# EAGLE design CharliesAlienWhoopF4 (EAGLE 8.1.0)
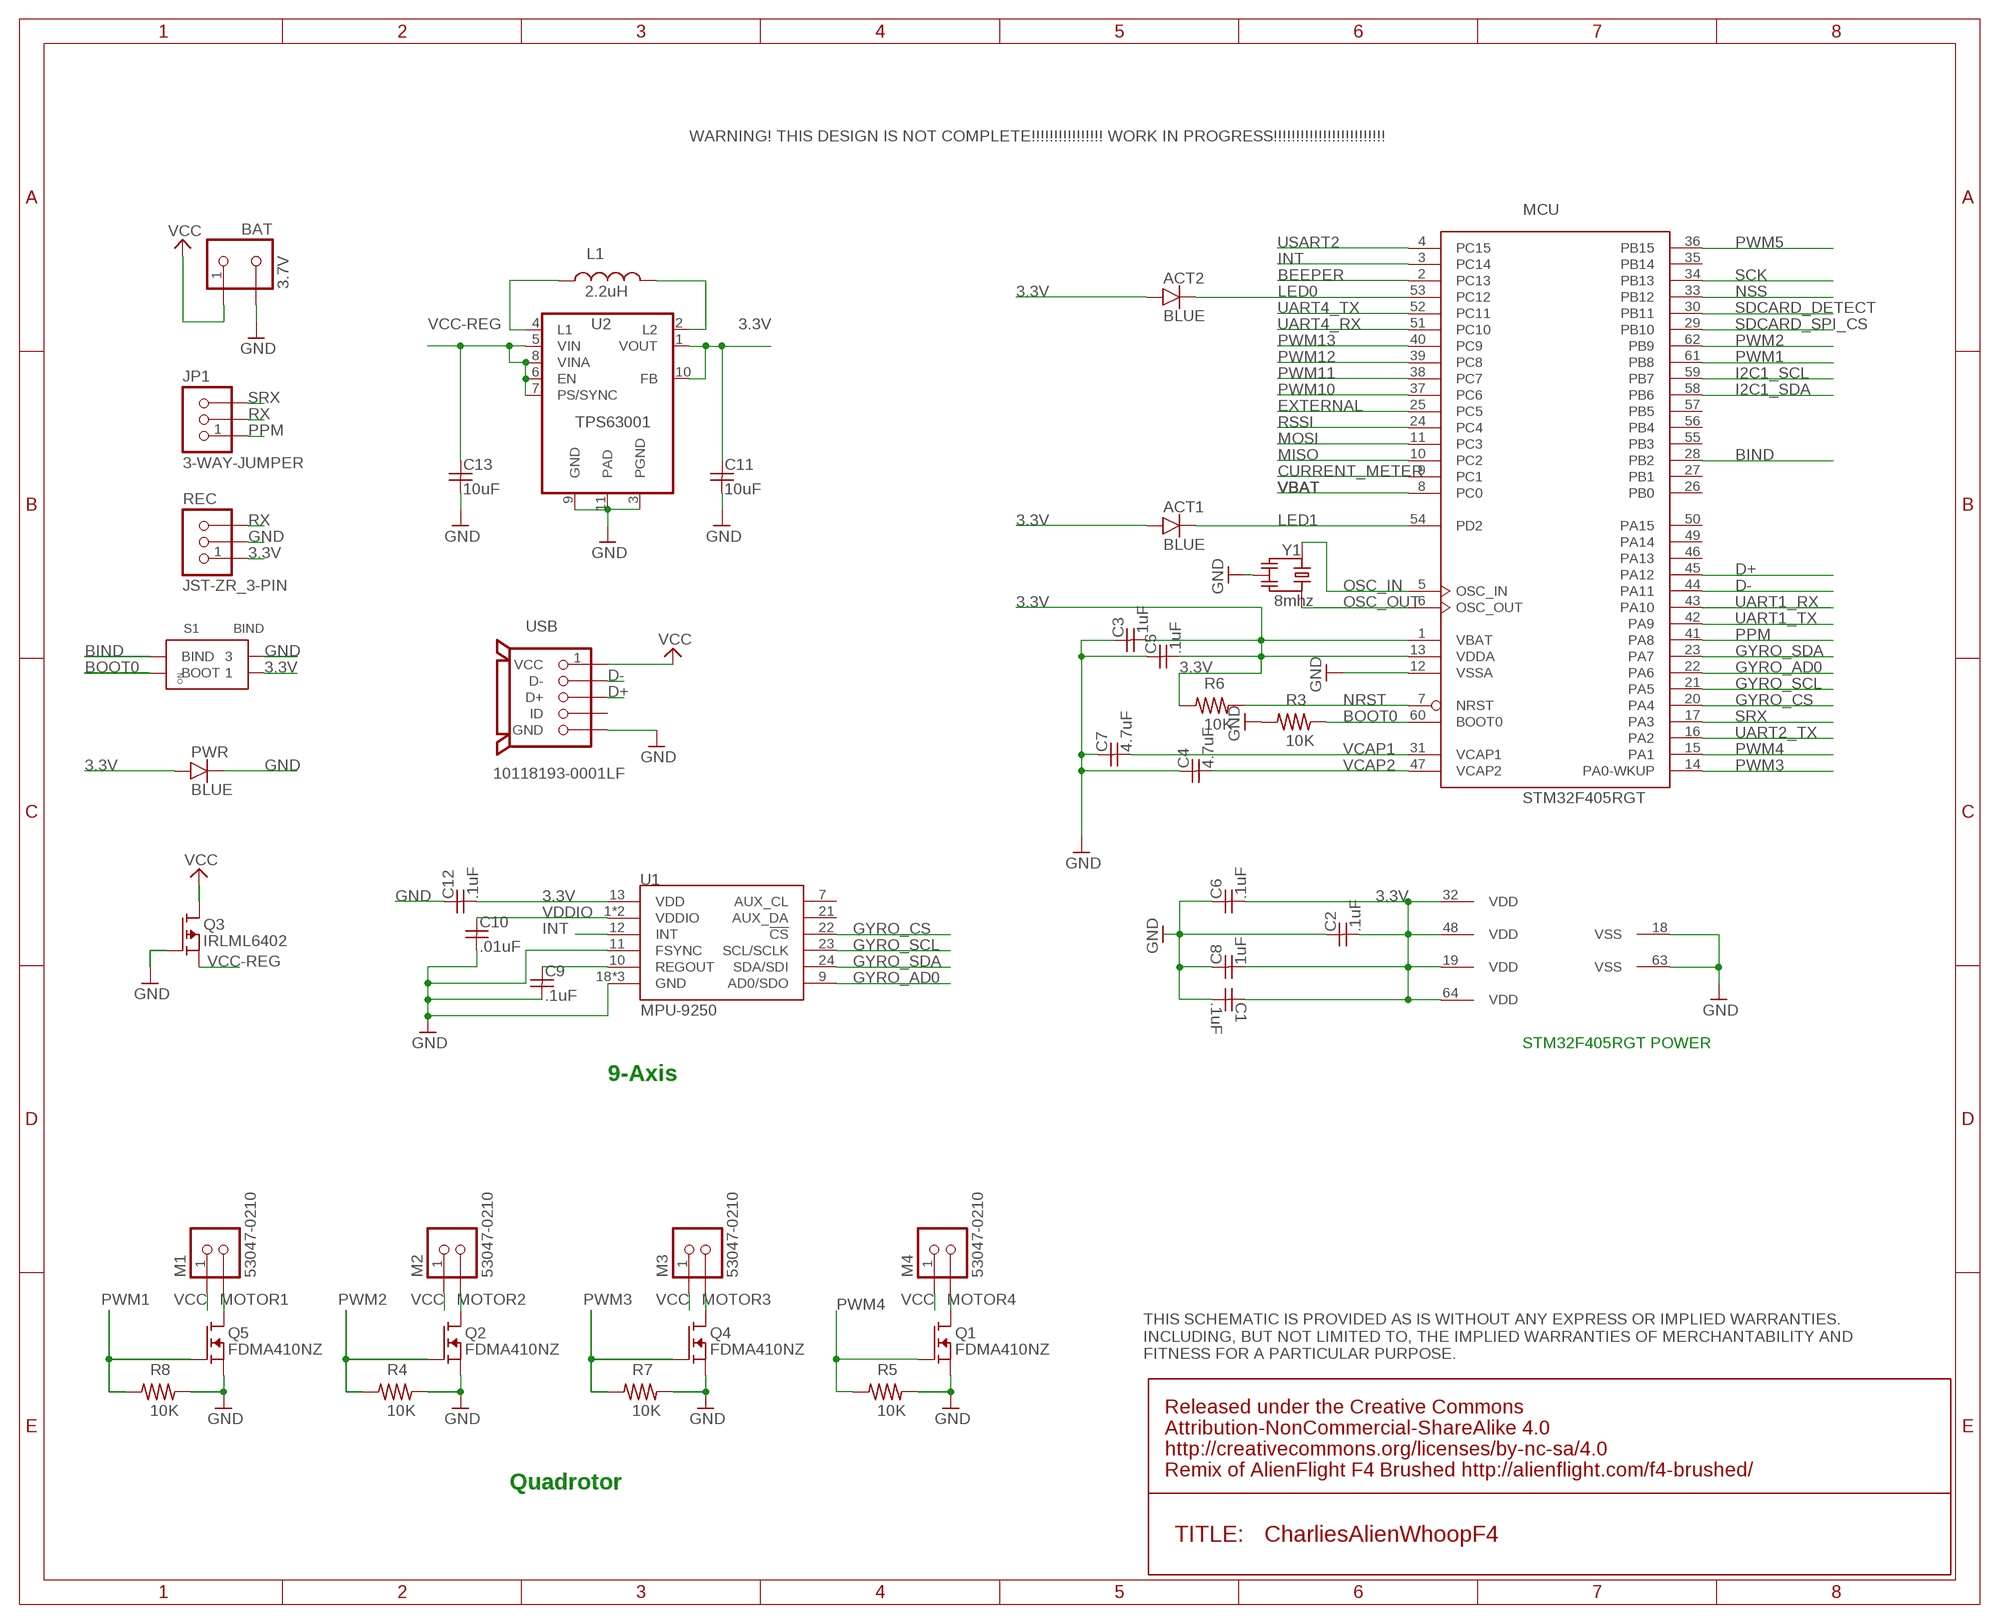
[diagram p0: schematic, sheet 1]

## Parts
ACT1  BLUE  SMD-CHIP-LED-0805  [SMD-CHIP-LED-0805]
ACT2  BLUE  SMD-CHIP-LED-0805  [SMD-CHIP-LED-0805]
BAT  3.7V  JST-PH-BAT  [S2B-PH-K-S]
C1  .1uF  CAPACITOR.1UF  [MUR-CAP-0603]
C2  .1uF  CAPACITOR.1UF  [MUR-CAP-0603]
C3  .1uF  CAPACITOR.1UF  [MUR-CAP-0603]
C4  4.7uF  CAPACITOR4.7UF  [MUR-CAP-0603]
C5  .1uF  CAPACITOR.1UF  [MUR-CAP-0603]
C6  .1uF  CAPACITOR.1UF  [MUR-CAP-0603]
C7  4.7uF  CAPACITOR4.7UF  [MUR-CAP-0603]
C8  1uF  CAPACITOR1UF  [MUR-CAP-0603]
C9  .1uF  CAPACITOR.1UF  [MUR-CAP-0603]
C10  .01uF  CAPACITOR.01UF  [MUR-CAP-0603]
C11  10uF  CAPACITOR10UF  [YUDEN-CAP-0805]
C12  .1uF  CAPACITOR.1UF  [MUR-CAP-0603]
C13  10uF  CAPACITOR10UF  [YUDEN-CAP-0805]
JP1  3-WAY-JUMPER  [3-WAY-JUMPER]
L1  2.2uH  NR301X  [NR301X]
M1  53047-0210  PICO-1.25-MOTOR  [PICO-53047-02]
M2  53047-0210  PICO-1.25-MOTOR  [PICO-53047-02]
M3  53047-0210  PICO-1.25-MOTOR  [PICO-53047-02]
M4  53047-0210  PICO-1.25-MOTOR  [PICO-53047-02]
MCU  STM32F405RGT  [LQFP64]
PWR  BLUE  SMD-CHIP-LED-0805  [SMD-CHIP-LED-0805]
Q1  FDMA410NZ  [MICROFET-2X2]
Q2  FDMA410NZ  [MICROFET-2X2]
Q3  IRLML6402  MOSFET-P  [SOT-23]
Q4  FDMA410NZ  [MICROFET-2X2]
Q5  FDMA410NZ  [MICROFET-2X2]
R3  10K  RESISTOR10K  [VISH-RES-0603]
R4  10K  RESISTOR10K  [VISH-RES-0603]
R5  10K  RESISTOR10K  [VISH-RES-0603]
R6  10K  RESISTOR10K  [VISH-RES-0603]
R7  10K  RESISTOR10K  [VISH-RES-0603]
R8  10K  RESISTOR10K  [VISH-RES-0603]
REC  JST-ZR_3-PIN  [S3B-ZR]
S1  BIND  2POS-DIP-SWITCH  [A6H-2101]
U1  MPU-9250  [QFN24_PAD]
U2  TPS63001  TPS630XX-TPS63001  [VSON-N10]
USB  10118193-0001LF  USB-MICRO-B-FCI  [10118193-0001LF]
Y1  8mhz  RESONATOR8MHZ  [RESONATOR_8]

## Nets
3.3V: ACT1.A ACT2.A C1.1 C2.2 C3.2 C5.2 C6.2 C8.2 C11.1 C12.2 MCU.1(VBAT) MCU.13(VDDA) MCU.19(VDD) MCU.32(VDD) MCU.48(VDD) MCU.64(VDD) PWR.A R6.2 REC.1 S1.BOOT_1 U1.13(VDD) U2.1(VOUT) U2.10(FB)
BEEPER: MCU.2(PC13)
BIND: MCU.28(PB2) S1.BIND_2(BIND)
BOOT0: MCU.60(BOOT0) R3.1 S1.BOOT_2(BOOT)
CURRENT_METER: MCU.9(PC1)
D+: MCU.45(PA12) USB.3(D+)
D-: MCU.44(PA11) USB.2(D-)
EXTERNAL: MCU.25(PC5)
GND: BAT.2 C1.2 C2.1 C3.1 C4.1 C5.1 C6.1 C7.1 C8.1 C9.2 C10.2 C11.2 C12.1 C13.2 MCU.12(VSSA) MCU.18(VSS) MCU.63(VSS) PWR.C Q1.S Q1.S1(S) Q2.S Q2.S1(S) Q3.1(G) Q4.S Q4.S1(S) Q5.S Q5.S1(S) R3.2 R4.1 R5.1 R7.1 R8.1 REC.2 S1.BIND_1 U1.11(FSYNC) U1.18(GND) U1.20(GND) U1.CENTER(GND) U2.3(PGND) U2.9(GND) U2.11(PAD) USB.5(GND) USB.GND USB.GND2(GND) USB.HOLE1(GND) USB.HOLE2(GND) Y1.2
GYRO_AD0: MCU.22(PA6) U1.9(AD0/SDO)
GYRO_CS: MCU.20(PA4) U1.22(!CS)
GYRO_SCL: MCU.21(PA5) U1.23(SCL/SCLK)
GYRO_SDA: MCU.23(PA7) U1.24(SDA/SDI)
I2C1_SCL: MCU.59(PB7)
I2C1_SDA: MCU.58(PB6)
INT: MCU.3(PC14) U1.12(INT)
L1: L1.1 U2.4(L1)
L2: L1.2 U2.2(L2)
LED0: ACT2.C MCU.53(PC12)
LED1: ACT1.C MCU.54(PD2)
MISO: MCU.10(PC2)
MOSI: MCU.11(PC3)
MOTOR1: M1.2 Q5.D Q5.D1(D) Q5.D2(D) Q5.D3(D) Q5.D4(D)
MOTOR2: M2.2 Q2.D Q2.D1(D) Q2.D2(D) Q2.D3(D) Q2.D4(D)
MOTOR3: M3.2 Q4.D Q4.D1(D) Q4.D2(D) Q4.D3(D) Q4.D4(D)
MOTOR4: M4.2 Q1.D Q1.D1(D) Q1.D2(D) Q1.D3(D) Q1.D4(D)
NRST: MCU.7(NRST) R6.1
NSS: MCU.33(PB12)
OSC_IN: MCU.5(OSC_IN) Y1.1
OSC_OUT: MCU.6(OSC_OUT) Y1.3
PPM: JP1.1 MCU.41(PA8)
PWM1: MCU.61(PB8) Q5.G R8.2
PWM2: MCU.62(PB9) Q2.G R4.2
PWM3: MCU.14(PA0-WKUP) Q4.G R7.2
PWM4: MCU.15(PA1) Q1.G R5.2
PWM5: MCU.36(PB15)
PWM10: MCU.37(PC6)
PWM11: MCU.38(PC7)
PWM12: MCU.39(PC8)
PWM13: MCU.40(PC9)
REGOUT: C9.1 U1.10(REGOUT)
RSSI: MCU.24(PC4)
RX: JP1.2 REC.3
SCK: MCU.34(PB13)
SDCARD_DETECT: MCU.30(PB11)
SDCARD_SPI_CS: MCU.29(PB10)
SRX: JP1.3 MCU.17(PA3)
UART1_RX: MCU.43(PA10)
UART1_TX: MCU.42(PA9)
UART2_TX: MCU.16(PA2)
UART4_RX: MCU.51(PC10)
UART4_TX: MCU.52(PC11)
USART2: MCU.4(PC15)
VBAT: MCU.8(PC0)
VCAP1: C7.2 MCU.31(VCAP1)
VCAP2: C4.2 MCU.47(VCAP2)
VCC: BAT.1 M1.1 M2.1 M3.1 M4.1 Q3.3(D) USB.1(VCC)
VCC-REG: C13.1 Q3.2(S) U2.5(VIN) U2.6(EN) U2.7(PS/SYNC) U2.8(VINA)
VDDIO: C10.1 U1.1(VDDIO) U1.8(VDDIO)
Unconnected: MCU.26(PB0) MCU.27(PB1) MCU.35(PB14) MCU.46(PA13) MCU.49(PA14) MCU.50(PA15) MCU.55(PB3) MCU.56(PB4) MCU.57(PB5) U1.7(AUX_CL) U1.21(AUX_DA) USB.4(ID)

## Notes on the sheet
- WARNING! THIS DESIGN IS NOT COMPLETE!!!!!!!!!!!!!!!! WORK IN PROGRESS!!!!!!!!!!!!!!!!!!!!!!!!!
- STM32F405RGT POWER
- 9-Axis
- THIS SCHEMATIC IS PROVIDED AS IS WITHOUT ANY EXPRESS OR IMPLIED WARRANTIES.
   INCLUDING, BUT NOT LIMITED TO, THE IMPLIED WARRANTIES OF MERCHANTABILITY AND
   FITNESS FOR A PARTICULAR PURPOSE.
- Quadrotor

## Library data of the parts
ACT1 ACT2 PWR = alienflight:SMD-CHIP-LED-0805: SMD CHIP LED APHCM2012QBC/D-F01 View Datasheet <https://www.kingbrightusa.com/images/catalog/spec/APHCM2012QBC-D-F01.pdf> Author: Lance Source: http://alienflight.com License: CC BY SA <creativecommons.org/licenses/by-sa/4.0/>; MF: Kingbright; MPN: APHCM2012QBC/D-F01
BAT = alienflight:JST-PH-BAT: Battery Connector JST- S2B-PH-K-S View Datasheet <http://www.jst-mfg.com/product/pdf/eng/ePH.pdf> Author: Lance Source: http://alienflight.com License: CC BY SA <creativecommons.org/licenses/by-sa/4.0/>; MF: JST; MPN: S2B-PH-K-S
C1-C3 C5 C6 C9 C12 = alienflight:CAPACITOR: CAPACITORS Murata Datasheet <http://www.murata.com/~/media/webrenewal/support/library/catalog/products/capacitor/mlcc/c02e.ashx?la=en-us> Taiyo Yuden Datasheet <http://www.mouser.com/ds/2/396/mlcc11_hq_e-541564.pdf> Author: Lance Source: http://alienflight.com License: CC BY SA <creativecommons.org/licenses/by-sa/4.0/>; MF: Murata; MPN: GRM188R71C104KA01D
C4 C7 = alienflight:CAPACITOR: CAPACITORS Murata Datasheet <http://www.murata.com/~/media/webrenewal/support/library/catalog/products/capacitor/mlcc/c02e.ashx?la=en-us> Taiyo Yuden Datasheet <http://www.mouser.com/ds/2/396/mlcc11_hq_e-541564.pdf> Author: Lance Source: http://alienflight.com License: CC BY SA <creativecommons.org/licenses/by-sa/4.0/>; MF: Murata; MPN: GRJ188C70J475KE11D
C8 = alienflight:CAPACITOR: CAPACITORS Murata Datasheet <http://www.murata.com/~/media/webrenewal/support/library/catalog/products/capacitor/mlcc/c02e.ashx?la=en-us> Taiyo Yuden Datasheet <http://www.mouser.com/ds/2/396/mlcc11_hq_e-541564.pdf> Author: Lance Source: http://alienflight.com License: CC BY SA <creativecommons.org/licenses/by-sa/4.0/>; MF: Murata; MPN: GRM188R71C105KA12D
C10 = alienflight:CAPACITOR: CAPACITORS Murata Datasheet <http://www.murata.com/~/media/webrenewal/support/library/catalog/products/capacitor/mlcc/c02e.ashx?la=en-us> Taiyo Yuden Datasheet <http://www.mouser.com/ds/2/396/mlcc11_hq_e-541564.pdf> Author: Lance Source: http://alienflight.com License: CC BY SA <creativecommons.org/licenses/by-sa/4.0/>; MF: Murata; MPN: GRM188R71C103KA01D
C11 C13 = alienflight:CAPACITOR: CAPACITORS Murata Datasheet <http://www.murata.com/~/media/webrenewal/support/library/catalog/products/capacitor/mlcc/c02e.ashx?la=en-us> Taiyo Yuden Datasheet <http://www.mouser.com/ds/2/396/mlcc11_hq_e-541564.pdf> Author: Lance Source: http://alienflight.com License: CC BY SA <creativecommons.org/licenses/by-sa/4.0/>; MF: Taiyo Yuden; MPN: JMK212AB7106KG-T
JP1 = alienflight:3-WAY-JUMPER: 3 Way Jumper
L1 = alienflight:NR301X: 3X3mm Inductor NR3015T2R2M - Datasheet <http://datasheet.octopart.com/NR3015T2R2M-Taiyo-Yuden-datasheet-41181804.pdf> Author: Lance Source: http://alienflight.com License: CC BY SA <creativecommons.org/licenses/by-sa/4.0/>; MF: Taiyo Yuden; MPN: NR3015T2R2M
M1-M4 = alienflight:PICO-1.25-MOTOR: Motor Connector PicoBlade 1.25 53047-02 View Datasheet <http://www.molex.com/webdocs/datasheets/pdf/en-us/0530470210_PCB_HEADERS.pdf> Author: Lance Source: http://alienflight.com License: CC BY SA <creativecommons.org/licenses/by-sa/4.0/>; MF: MOLEX; MPN: 53047-0210
MCU = micro-stm_v2:STM32F405R*T: ARM 32-bit Cortex™-M3 CPU 168 MHz maximum frequency 1024 Kbytes of Flash memory 192 kbytes of SRAM 51 GPIOs 1.8 to 3.6 V application supply
Q1 Q2 Q4 Q5 = alienflight:FDMA410NZ: N-Channel MOSFET FDMA410NZ View Datasheet <https://www.fairchildsemi.com/datasheets/FD/FDMA410NZ.pdf> Author: Lance Source: http://alienflight.com License: CC BY SA <creativecommons.org/licenses/by-sa/4.0/>; MF: Fairchild; MPN: FDMA410NZ
Q3 = alienflight:MOSFET-P: P-Channel MOSFET IRLML6402 Datasheet <http://www.irf.com/product-info/datasheets/data/irlml6402pbf.pdf> Author: Lance Source: Alienflight.com License: CC BY SA <creativecommons.org/licenses/by-sa/4.0/>; MF: IR; MPN: IRLML6402
R3-R8 = alienflight:RESISTOR: RESISTORS Vishay DataSheet <http://www.vishay.com/docs/20043/crcwhpe3.pdf> Author: Lance (100 ohm variant by Charlie Stevenson) Source: http://alienflight.com License: CC BY SA <creativecommons.org/licenses/by-sa/4.0/>; MF: Vishay; MPN: CRCW060310K0FKEAHP
REC = alienflight:JST-ZR_3-PIN: 3 Pin Receiver JST - S3B-ZR View Datasheet <http://www.jst-mfg.com/product/pdf/eng/eZH.pdf> Author: Lance Source: http://alienflight.com License: CC BY SA <creativecommons.org/licenses/by-sa/4.0/>; MF: JST; MPN: S3B-ZR
S1 = CharliesAlienWhoop:2POS-DIP-SWITCH: 2 Position Dip Switch
U1 = Testing:MPU-9250: NC pin 19. 2-6 & 14-17 not internally connected. May be used for PCB trace routing.; PROD_ID: IC-13192
U2 = alienflight:TPS630XX: Buck/Boost Converter TPS63001/2 Datasheet <http://www.ti.com/lit/ds/symlink/tps63001.pdf> Author: Lance Source: http://alienflight.com License: CC BY SA <creativecommons.org/licenses/by-sa/4.0/>; MF: TI; MPN: TPS63001DRCR
USB = alienflight:USB-MICRO-B: Micro-B USB Connector Author: Lance Source: http://alienflight.com License: CC BY SA <creativecommons.org/licenses/by-sa/4.0/>; MF: FCI; MPN: 10118193-0001LF
Y1 = alienflight:RESONATOR: SMD Ceramic Resonators Ceralock Murata Datasheet <http://www.murata.com/~/media/webrenewal/support/library/catalog/products/timingdevice/ceralock/p16e.ashx> Author: Lance Source: http://alienflight.com License: CC BY SA <creativecommons.org/licenses/by-sa/4.0/>; MF: Murata; MPN: CSTCE8M00G55-R0

## Board
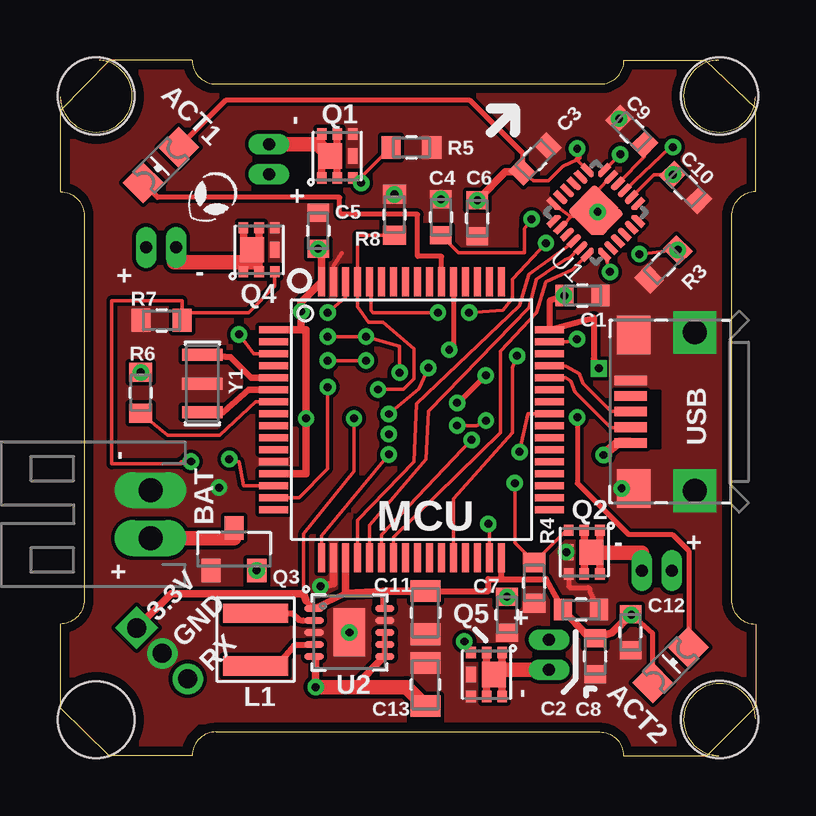
[diagram p1: board, top side]
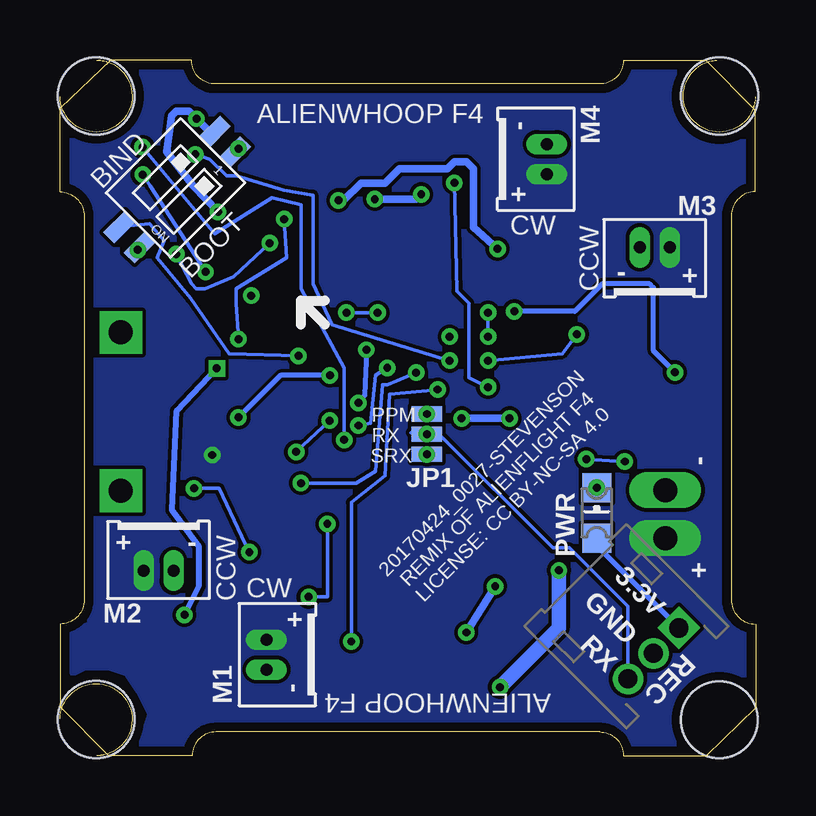
[diagram p2: board, bottom side, seen from below]

Size 29.01 x 28.99 mm. Coordinates in mm from the lower left corner, seen from the top.
Outline: 0.01,27.45 0.02,27.38
Outline: 0.02,27.34 0.02,27.33 0.02,27.3 0.04,27.23
Outline: 0.04,27.18 0.04,27.23
Outline: 0.04,27.23 0.04,27.19 0.04,27.18
Outline: 0.04,27.18 0.05,27.16 0.07,27.08
Outline: 0.08,27.05 0.07,27.08
Outline: 0.07,27.08 0.08,27.05 0.08,27.05
Outline: 0.08,27.05 0.08,27.02 0.12,26.92 0.13,26.89 0.2,26.76 0.27,26.64 0.36,26.52 0.46,26.42 0.56,26.32 0.68,26.24 0.8,26.17 0.93,26.11 1.07,26.06 1.22,26.02 1.36,26 1.51,25.99 1.66,25.99 1.8,26.01 1.94,26.05 2.09,26.1 2.21,26.16 2.34,26.24 2.46,26.33 2.57,26.43 2.68,26.55 2.77,26.66 2.84,26.79 2.9,26.92 2.95,27.06 2.99,27.2 3.01,27.35 3.02,27.49 3.01,27.64 2.98,27.79 2.95,27.93 2.9,28.07 2.84,28.2 2.76,28.32 2.68,28.44 2.58,28.55 2.48,28.64 2.36,28.73 2.24,28.81 2.11,28.87 1.98,28.92 1.96,28.93 1.95,28.93 1.93,28.93 1.84,28.96 1.82,28.96 1.81,28.96 1.78,28.97 1.7,28.98 1.68,28.98 1.66,28.98 1.63,28.98
Outline: 27.24,0.03 27.32,0.01 27.34,0.01 27.35,0.01 27.39,0.01 27.47,0
Outline: 27.19,0.03 27.2,0.03 27.24,0.03
Outline: 27.24,0.03 27.19,0.03
Outline: 27.19,0.03 27.17,0.04 27.09,0.06 27.06,0.06 27.06,0.07 27.04,0.07 26.91,0.12 26.77,0.19 26.65,0.26 26.54,0.35 26.43,0.44 26.34,0.55 26.25,0.67 26.18,0.79 26.12,0.92 26.07,1.06 26.03,1.21 26.01,1.35 26,1.5 26.01,1.64 26.03,1.79 26.06,1.93 26.11,2.08 26.17,2.2 26.25,2.33 26.34,2.45 26.44,2.56 26.56,2.66 26.68,2.75 26.8,2.83 26.93,2.89 27.07,2.94 27.21,2.98 27.36,3 27.5,3 27.65,3 27.8,2.97 27.94,2.94 28.08,2.89 28.21,2.83 28.33,2.75 28.45,2.67 28.56,2.57 28.66,2.47 28.74,2.35 28.82,2.23 28.88,2.1 28.93,1.97 28.94,1.94 28.94,1.94 28.94,1.92 28.97,1.83 28.97,1.81 28.97,1.8 28.98,1.76 28.99,1.69 28.99,1.66 28.99,1.65 29,1.62 29,1.54
Outline: 29,27.45 29,27.38 28.99,27.34 28.99,27.33 28.99,27.3 28.98,27.23 28.97,27.19 28.97,27.18 28.97,27.16 28.94,27.07
Outline: 28.94,27.05 28.94,27.05 28.94,27.07
Outline: 28.94,27.07 28.94,27.05
Outline: 28.94,27.05 28.93,27.02 28.88,26.89 28.82,26.76 28.74,26.64 28.66,26.52 28.56,26.42 28.45,26.32 28.33,26.24 28.21,26.17 28.08,26.11 27.94,26.06 27.8,26.02 27.65,26 27.5,25.99 27.36,25.99 27.21,26.01 27.07,26.05 26.93,26.1 26.8,26.16 26.68,26.24 26.56,26.33 26.44,26.43 26.34,26.55 26.25,26.66 26.17,26.79 26.11,26.92 26.06,27.06 26.03,27.2 26.01,27.35 26,27.49 26.01,27.64 26.03,27.79 26.07,27.93 26.12,28.07 26.18,28.2 26.25,28.32 26.34,28.44 26.43,28.55 26.54,28.64 26.65,28.73 26.77,28.81 26.91,28.87 27.04,28.92 27.06,28.92 27.06,28.93 27.09,28.93 27.17,28.96 27.19,28.96 27.2,28.96 27.24,28.97 27.32,28.98 27.34,28.98 27.39,28.98
Outline: 27.39,28.98 27.35,28.98
Outline: 27.47,28.99 27.39,28.98
Outline: 0.03,23.5 0.03,26.9 2.08,28.98 5.51,28.98 arc90 6.5,27.99 22.53,27.99 arc90 23.52,28.98 26.9,28.98 29.01,26.97 29.01,23.5 arc90 27.99,22.48 27.99,6.5 arc90 29.01,5.49 29.01,2.03 26.97,0 23.5,0 arc90 22.5,0.99 6.5,0.99 arc90 5.51,0 2.06,0 0,2.01 0,5.49 arc90 1.02,6.5 1.02,22.5 arc90 0.03,23.5
Copper layers (1*16): Top 0.0356mm / dielectric 1.5011mm / Bottom 0.0356mm
Design rules "oshpark-2layer": minimum track width 6mil, minimum drill 13mil, track to track 6mil, track to pad 6mil, pad to pad 6mil, via to via 6mil, smd to smd 6mil, copper to edge 15mil, drill to drill 6mil, minimum pad ring 7mil, minimum via ring 7mil, stop-mask expansion 2.5mil, vias tented up to drill 0mil, thermal gap 10mil
Holes 3.2 mm at 1.51,27.49 27.5,27.49 27.5,1.51 1.52,1.51

### Footprints (pad centres in the part's own frame; a part is rotated, then mirrored left to right if it is on the bottom)
SMD-CHIP-LED-0805 = smd 1.2 x 1.2: A -1.05,0; C 1.05,0
S2B-PH-K-S = drill 1 long: 1 1,0; 2 -1,0
MUR-CAP-0603 = smd 0.75 x 0.9: 1 -0.75,0; 2 0.75,0
YUDEN-CAP-0805 = smd 0.9 x 1.25: 1 -0.9,0; 2 0.9,0
3-WAY-JUMPER = smd 0.635 x 1.27: 1 -0.84,0; 2 0,0; 3 0.84,0
NR301X = smd 2.7 x 0.8: 1 0,1.1; 2 0,-1.1
PICO-53047-02 = drill 0.5 pad 0.813 long: 1 0.625,0; 2 -0.625,0
LQFP64 = smd 0.3 x 1.2: 1 -3.75,-5.75; 2 -3.25,-5.75; 3 -2.75,-5.75; 4 -2.25,-5.75; 5 -1.75,-5.75; 6 -1.25,-5.75; 7 -0.75,-5.75; 8 -0.25,-5.75; 9 0.25,-5.75; 10 0.75,-5.75; 11 1.25,-5.75; 12 1.75,-5.75; 13 2.25,-5.75; 14 2.75,-5.75; 15 3.25,-5.75; 16 3.75,-5.75; 33 3.75,5.75; 34 3.25,5.75; 35 2.75,5.75; 36 2.25,5.75; 37 1.75,5.75; 38 1.25,5.75; 39 0.75,5.75; 40 0.25,5.75; 41 -0.25,5.75; 42 -0.75,5.75; 43 -1.25,5.75; 44 -1.75,5.75; 45 -2.25,5.75; 46 -2.75,5.75; 47 -3.25,5.75; 48 -3.75,5.75 | smd 1.2 x 0.3: 17 5.75,-3.75; 18 5.75,-3.25; 19 5.75,-2.75; 20 5.75,-2.25; 21 5.75,-1.75; 22 5.75,-1.25; 23 5.75,-0.75; 24 5.75,-0.25; 25 5.75,0.25; 26 5.75,0.75; 27 5.75,1.25; 28 5.75,1.75; 29 5.75,2.25; 30 5.75,2.75; 31 5.75,3.25; 32 5.75,3.75; 49 -5.75,3.75; 50 -5.75,3.25; 51 -5.75,2.75; 52 -5.75,2.25; 53 -5.75,1.75; 54 -5.75,1.25; 55 -5.75,0.75; 56 -5.75,0.25; 57 -5.75,-0.25; 58 -5.75,-0.75; 59 -5.75,-1.25; 60 -5.75,-1.75; 61 -5.75,-2.25; 62 -5.75,-2.75; 63 -5.75,-3.25; 64 -5.75,-3.75
MICROFET-2X2 = smd 1 x 1.05: D -0.3,0 | smd 0.4 x 0.47: D1 -0.65,0.915; D2 0,0.915; D3 -0.65,-0.915; D4 0,-0.915; G 0.65,-0.915; S1 0.65,0.915 | smd 0.4 x 0.66: S 0.65,0
SOT-23 = smd 0.802 x 0.972: 1 -0.95,-0.885; 2 0.95,-0.885; 3 0,0.885
VISH-RES-0603 = smd 0.8 x 0.95: 1 -0.85,0; 2 0.85,0
S3B-ZR = drill 0.8 pad 1.27 square: 1 -1.5,0 | drill 0.8 pad 1.27: 2 0,0; 3 1.5,0
A6H-2101 = smd 0.635 x 1.27: BIND_1 0.6,-2.8; BIND_2 0.6,2.8; BOOT_1 -0.6,-2.8; BOOT_2 -0.6,2.8
QFN24_PAD = smd 0.5 x 0.25: 1 -1.55,1; 2 -1.55,0.6; 3 -1.55,0.2; 4 -1.55,-0.2; 5 -1.55,-0.6; 6 -1.55,-1; 13 1.55,-1; 14 1.55,-0.6; 15 1.55,-0.2; 16 1.55,0.2; 17 1.55,0.6; 18 1.55,1 | smd 0.08 x 0.13: 1$1 -1.32,1.06; 1$3 -1.26,0.94; P$33 1.26,-0.94; P$34 1.32,-1.06; P$58 1.26,0.94; P$59 1.32,1.06; P$68 -1.26,-0.94; P$69 -1.32,-1.06 | smd 0.1 x 0.185 rotated 45: 1$2 -1.25,1.024; P$49 1.024,-1.25 | smd 0.14 x 0.14: 1$4 -1.22,0.945; P$23 -0.945,-1.22; P$24 1.22,-0.945; P$36 0.945,1.22; P$51 0.945,-1.22; P$56 1.22,0.945; P$61 -0.945,1.22; P$66 -1.22,-0.945 | smd 0.05 x 0.05: 1$5 -1.175,0.97; P$25 -0.97,-1.175; P$31 1.175,-0.97; P$37 0.97,1.175; P$52 0.97,-1.175; P$57 1.175,0.97; P$62 -0.97,1.175; P$67 -1.175,-0.97 | smd 0.25 x 0.5: 7 -1,-1.55; 8 -0.6,-1.55; 9 -0.2,-1.55; 10 0.2,-1.55; 11 0.6,-1.55; 12 1,-1.55; 19 1,1.55; 20 0.6,1.55; 21 0.2,1.55; 22 -0.2,1.55; 23 -0.6,1.55; 24 -1,1.55 | smd 0.25 x 0.25: CENTER 0,0 | smd 0.4 x 0.4: DBBADFE -0.675,0.24 | smd 0.6 x 1.2: DBBADFE1 -0.575,-0.195 | smd 0.25 x 0.3: P$1 -0.2,1.3; P$3 0.2,1.3; P$5 0.6,1.3; P$11 -0.6,1.3; P$16 0.2,-1.3; P$18 -0.2,-1.3; P$20 -0.6,-1.3; P$26 0.6,-1.3 | smd 0.3 x 0.25: P$2 -1.3,0.2; P$4 -1.3,0.6; P$28 -1.3,-0.2; P$38 -1.3,-0.6; P$40 1.3,0.2; P$42 1.3,-0.2; P$44 1.3,-0.6; P$50 1.3,0.6 | smd 0.1 x 0.185 rotated 225: P$7 1.25,-1.024; P$60 -1.024,1.25 | smd 1.1 x 1.59: P$13 0.325,0 | smd 0.3 x 0.5 rotated 315: P$14 -0.592,0.512 | smd 0.5 x 1.59: P$15 -0.27,0 | smd 0.1 x 0.185 rotated 135: P$22 -1.024,-1.25; P$55 1.25,1.024 | smd 0.13 x 0.08: P$27 -0.94,-1.26; P$29 -1.06,-1.32; P$39 0.94,1.26; P$41 1.06,1.32; P$53 0.94,-1.26; P$54 1.06,-1.32; P$63 -0.94,1.26; P$64 -1.06,1.32 | smd 0.1 x 0.185 rotated 315: P$35 1.024,1.25; P$65 -1.25,-1.024
VSON-N10 = smd 0.8 x 0.26: 1 -1.475,1; 2 -1.475,0.5; 3 -1.475,0; 4 -1.475,-0.5; 5 -1.475,-1; 6 1.475,-1; 7 1.475,-0.5; 8 1.475,0; 9 1.475,0.5; 10 1.475,1 | smd 1.3 x 2: 11 0,0
10118193-0001LF = smd 0.4 x 1.35: 1 1.3,-4.125; 2 0.65,-4.125; 3 0,-4.125; 4 -0.65,-4.125; 5 -1.3,-4.125 | smd 1.6 x 1.4: GND -3.2,-4; GND2 3.2,-4 | drill 1 pad 1.778 square: HOLE1 -3.3,-1.45; HOLE2 3.3,-1.45
RESONATOR_8 = smd 0.5 x 1.7: 1 -1.2,0; 2 0,0; 3 1.2,0

### Placement (x,y rotation side)
ACT1  4.21,24.61 225 top
ACT2  25.45,3.78 45 top
BAT  3.78,10.07 270 top
C1  21.78,19.18 0 top
C2  21.73,6.09 180 top
C3  19.81,24.86 225 top
C4  15.88,22.45 270 top
C5  10.76,21.87 270 top
C6  17.4,22.39 90 top
C7  18.64,5.87 90 top
C8  22.31,4.14 90 top
C9  23.84,26.01 135 top
C10  26.09,23.69 315 top
C11  15.24,5.96 270 top
C12  23.79,5.14 90 top
C13  15.24,2.97 90 top
JP1  13.71,13.4 270 bottom
L1  8.16,4.84 180 top
M1  20.39,4.21 90 bottom
M2  24.89,7.71 180 bottom
M3  4.21,21.18 0 bottom
M4  8.71,24.86 270 bottom
MCU  14.66,14 270 top
PWR  6.63,10.12 90 bottom
Q1  11.56,24.99 0 top
Q2  21.86,8.49 180 top
Q3  7.26,8.61 0 top
Q4  8.3,21.08 0 top
Q5  17.79,3.38 180 top
R3  25.16,20.48 225 top
R4  19.77,7.21 90 top
R5  14.65,25.35 180 top
R6  3.37,15.13 90 top
R7  4.24,18.14 0 top
R8  13.95,22.54 270 top
REC  4.26,4.27 225 bottom
S1  24.12,23.59 135 bottom
U1  22.34,22.64 135 top
U2  12.07,5.14 0 top
USB  27.92,14.34 270 top
Y1  5.94,15.51 270 top

### Tracks (layer width: path | path; a pad name or v marks a point on that pad's centre or on a via)
3.3V  (via drill 0.33)
  Top 0.152: 10.16,6.76 10.16,9.26 12.26,11.86 v12.26,14.06 | C3.2 19.75,23.96 20.36,23.96 20.96,24.56 21.56,24.84 U1.13
  Top 0.203: ACT1.A 6.93,27.33 17.07,27.33 19.28,25.12 C3.2 | ACT2.A 24.71,5.09 v23.82,5.87 | 21.56,24.84 21.64,24.91 21.6,25.12 v21.56,25.3
  Top 0.254: 13.46,6.86 13.46,6.14 U2.10 | 11.91,6.76 U2.1 10.26,6.47 | C11.1 17.86,6.86 17.86,7.36 18.41,7.36 | 18.41,7.36 MCU.32 | C1.1 20.41,18.96 MCU.48 22.26,18.26 22.26,16.56 v22.47,16.14 | 18.41,7.36 20.26,7.36 C2.2 | v23.82,5.87 23.34,5.34 23.28,5.39
  Top 0.305: MCU.19 11.91,6.76 13.46,6.86 C11.1 | 10.26,6.47 10.16,6.76 4.64,6.76 REC.1 | MCU.13 10.25,11.75 v10.26,14.06 10.26,17.75 10.06,17.75 | 10.06,17.75 MCU.1 | C5.2 10.91,21.17 MCU.64 10.06,18.91 v10.06,18.52 10.06,17.75 | C12.2 23.28,5.39 23.01,5.12 C8.2 22.01,4.98 C2.2 | C3.2 18.58,24.33 C6.2
  Bottom 0.152: S1.BOOT_1 v21.56,25.3
  Bottom 0.203: PWR.A 6.63,8.75 REC.1 | R6.2 4.27,16.88 4.27,19.51 4.42,19.66 6.4,19.66 7.54,18.52 v10.06,18.52
  Bottom 0.254: v23.82,5.87 23.21,7.09 23.21,8.71 24.34,10.24 24.14,14.39 v22.47,16.14
  Bottom 0.305: v12.26,14.06 v10.26,14.06 | C5.2 11.76,22.02 11.76,24.46 12.06,24.76 12.56,24.76 12.86,24.46 14.86,24.46 15.46,23.86 16.46,23.86 17.18,23.14 C6.2
  other vias: 10.76,21.12 17.4,23.14 21.03,19.18 3.37,15.98
BIND  (via drill 0.33)
  Top 0.152: MCU.28 16.41,10.71 18.86,13.46 18.86,16.16 v19.06,16.66
  Bottom 0.152: v19.06,16.66 21.96,16.76 23.56,19.06 24.96,20.76 24.66,21.46 25.26,22.16 S1.BIND_2
BOOT0  (via drill 0.33)
  Top 0.152: MCU.60 12.96,19.7 12.96,18.56 13.06,18.46 v15.76,18.46 | v17.06,18.46 18.46,18.56 18.86,19.06 18.86,19.86 v20.26,21.36 | v24.16,20.9 R3.1
  Top 0.254: R3.1 25.71,20.96
  Bottom 0.152: v15.76,18.46 v17.06,18.46 | v20.26,21.36 21.76,19.96 22.96,19.46 23.32,19.46 23.52,19.66 v24.16,20.9
  Bottom 0.33: S1.BOOT_2 25.76,21.1 R3.1
  other vias: 25.76,21.08
D+
  Top 0.152: MCU.45 21.08,16.23 21.66,15.91 21.81,15.51 22.96,14.36 23.77,14.36 USB.3
D-
  Top 0.152: MCU.44 21.09,15.75 21.31,15.61 21.46,15.16 22.96,13.66 23.76,13.66 USB.2
GND  (via drill 0.33)
  Top 0.152: U1.11 22.34,23.49 U1.CENTER 22.36,22.66 v22.42,22.66 | MCU.63 11.41,20.41 11.76,20.96 | U1.20 21.52,22.66 v22.42,22.66 | U1.18 21.31,22.46 v22.42,22.66
  Top 0.203: Q2.S1 21.21,7.06 21.26,7.01 22.02,7.01 22.1,6.93 22.1,6.85 C2.1
  Top 0.305: MCU.18 11.41,7.16 v10.86,7.06
  Bottom 0.152: v21.11,8.49 22.37,11.14 v23.42,11.14
  Bottom 0.305: v10.86,7.06 U2.11 | S1.BIND_1 22.77,26 C9.2 23.63,26.86 24.16,26.86 24.36,26.66 24.56,25.16 23.46,23.76 v22.42,22.66 | R8.1 14.14,23.2 C4.1
  other vias: 12.07,5.14 23.31,26.54 13.95,23.39 15.88,23.2 6.63,11.17
  pour Top (isolate 0.076, no thermals): 0.46,25.71 0.46,23.96 1.21,23.21 1.46,22.46 1.46,6.46 1.21,5.71 0.96,5.46 0.46,5.21 0.31,2.85 0.88,3.26 2.01,3.49 2.71,3.21 3.21,2.46 3.46,1.96 3.46,1.21 3.21,0.46 4.96,0.46 5.21,0.96 5.71,1.46 22.46,1.46 23.21,1.21 23.71,0.71 23.71,0.46 25.71,0.46 25.46,1.21 25.46,1.71 25.71,2.46 25.96,2.96 26.71,3.21 27.71,3.46 28.46,3.21 28.71,2.96 28.71,5.21 28.21,5.46 27.71,5.96 27.76,22.96 28.71,23.76 28.71,25.96 28.21,25.81 27.19,25.78 26.74,25.93 25.88,26.76 25.66,28.06 26.41,28.81 23.96,28.71 23.36,28.06 22.86,27.81 6.01,27.81 5.16,28.81 2.71,28.71 3.46,27.96 3.46,27.21 3.21,26.46 2.96,25.96 2.21,25.71 1.71,25.46
GYRO_AD0  (via drill 0.33)
  Top 0.152: MCU.22 13.41,9.21 v17.16,13.16 | U1.9 25.45,25.36 v25.56,25.36
  Bottom 0.152: v25.56,25.36 22.56,21.76 20.16,23.26 18.96,22.96 18.96,19.46 17.16,16.16 v17.16,13.16
GYRO_CS
  Top 0.152: MCU.20 12.41,9.81 14.76,12.26 14.86,14.66 19.16,18.76 19.56,20.06 21.4,21.4 U1.22
GYRO_SCL
  Top 0.152: MCU.21 12.91,9.61 15.26,12.36 15.36,14.36 19.56,18.66 19.86,19.86 21.06,20.66 21.26,20.76 21.62,21.12 U1.23
GYRO_SDA
  Top 0.152: MCU.23 13.91,9.11 18.36,13.46 18.36,16.86 19.86,18.46 20.26,19.76 21.36,20.26 21.58,20.46 U1.24
INT  (via drill 0.33)
  Top 0.152: U1.12 22.84,24.54 v23.36,25.06 | v12.76,16.46 v11.16,16.46 | v7.46,17.56 8.07,16.75 MCU.3
  Bottom 0.152: v23.36,25.06 22.76,24.86 22.06,24.16 21.66,24.16 19.66,23.56 18.46,23.36 18.46,19.66 17.66,17.96 v12.76,16.46 | v11.16,16.46 8.06,16.76 v7.46,17.56
L1
  Top 0.254: L1.1 9.04,3.74 9.81,4.64 U2.4
L2
  Top 0.254: L1.2 9.68,5.94 9.96,5.66 10.14,5.64 U2.2
LED0  (via drill 0.33)
  Top 0.203: MCU.53 16.41,17.1 v16.23,16.92 | v16.56,14.71 16.61,14.71 v17.75,15.85 | v21.56,14.1 21.56,11.35 23.7,9.22 25.53,9.22 26.21,8.53 26.21,4.54 ACT2.C
  Bottom 0.203: v16.23,16.92 16.31,15.01 v16.56,14.71 | v17.75,15.85 19.81,15.85 v21.56,14.1
LED1
  Top 0.203: MCU.54 15.91,20.8 14.91,20.8 14.91,22.56 11.66,22.56 11.66,23.27 4.07,23.27 ACT1.C
MOTOR1
  Top 0.305: 17.79,3.38 Q5.D4 | 18.44,3.38 Q5.D3 | 18.44,3.38 Q5.D 17.79,3.38 | 18.44,3.38 Q5.D1 | 17.79,3.38 Q5.D2
  Top 0.61: M1.2 18.09,3.59 Q5.D
MOTOR2
  Top 0.305: 21.86,8.49 Q2.D4 | 22.51,8.49 Q2.D3 | 22.51,8.49 Q2.D 21.86,8.49 | 22.51,8.49 Q2.D1 | 21.86,8.49 Q2.D2
  Top 0.61: M2.2 24.26,8.46 22.16,8.46 Q2.D
MOTOR3
  Top 0.305: 8.3,21.08 Q4.D2 | 7.65,21.08 Q4.D1 | 7.65,21.08 Q4.D 8.3,21.08 | 7.65,21.08 Q4.D3 | 8.3,21.08 Q4.D4
  Top 0.61: M3.2 4.76,21.18 4.76,20.56 8,20.56 Q4.D
MOTOR4
  Top 0.305: 10.91,24.99 Q1.D1 | 11.56,24.99 Q1.D2 | 11.56,24.99 Q1.D 10.91,24.99 | 11.56,24.99 Q1.D4 | 10.91,24.99 Q1.D3
  Top 0.61: M4.2 10.76,25.49 Q1.D
NRST
  Top 0.152: MCU.7 8.15,14.75 6.66,13.36 4.49,13.36 R6.1
OSC_IN
  Top 0.279: Y1.1 7.11,16.61 7.96,15.76 MCU.5
  Top 0.305: MCU.5
OSC_OUT
  Top 0.279: Y1.3 6.81,14.31 7.86,15.26 MCU.6
  Top 0.305: MCU.6
PPM  (via drill 0.33)
  Top 0.152: MCU.41 19.52,14.26 v19.16,12.66 | v17.76,13.96 17.36,13.76 v16.56,13.76 | JP1.1 14.96,15.29 v15.36,16.16
  Bottom 0.152: v19.16,12.66 v17.76,13.96 | v15.36,16.16 15.86,15.86 16.06,13.86 v16.56,13.76
  other vias: 13.71,14.24
PWM1  (via drill 0.33)
  Top 0.152: Q5.G 17.14,4.49 v16.86,4.76 | 12.46,19.7 MCU.61 | R8.2 12.41,21.69 MCU.61 | MCU.61 12.41,18.71 12.86,18.06 13.46,18.06 14.76,16.96 14.76,15.7 14.33,15.27 v13.26,15.27 v13.26,15.26
  Bottom 0.152: v16.86,4.76 16.86,10.56 15.46,11.66 15.26,15.06 v13.26,15.26
PWM2  (via drill 0.33)
  Top 0.152: Q2.G 21.12,9.4 R4.2 18.96,8.87 v18.96,11.36 | v14.16,15.96 14.16,17.06 v12.76,17.46 v11.16,17.46 | MCU.62 11.91,19.11 v11.16,18.46
  Bottom 0.152: v18.96,11.36 16.66,11.36 15.86,11.86 15.56,15.46 15.36,15.46 v14.16,15.96 | v11.16,18.46 v11.16,17.46
PWM3  (via drill 0.33)
  Top 0.152: Q4.G 8.95,19.55 7.86,18.46 5.4,18.46 R7.2 5.09,18.96 2.16,18.96 2.16,12.16 5.06,12.16 5.06,12.26 v5.46,12.26 | MCU.14 7.66,11.26 7.46,12.26 v7.06,12.36
  Bottom 0.152: v7.06,12.36 v5.46,12.26
PWM4  (via drill 0.33)
  Top 0.152: R5.2 12.53,24.07 v12.56,23.87 Q1.G | v11.16,15.36 11.16,11.96 9.96,10.76 MCU.15
  Bottom 0.152: v12.56,23.87 12.46,19.36 11.96,18.86 11.96,15.76 v11.16,15.36
REGOUT
  Top 0.152: U1.10 24.37,24.95 C9.1
RX  (via drill 0.33)
  Bottom 0.152: REC.3 5.32,6.22 7.76,8.66 8.46,8.66 13.26,13.46 14.37,13.46 JP1.2
  other vias: 13.71,13.4
SRX  (via drill 0.33)
  Top 0.152: MCU.17 10.91,9.16 JP1.3
  other vias: 13.71,12.56
VCAP1  (via drill 0.33)
  Top 0.152: v17.86,9.66 17.91,9.61 MCU.31
  Bottom 0.152: C7.2 17.86,6.62 v17.86,9.66
  other vias: 18.64,6.62
VCAP2  (via drill 0.33)
  Top 0.152: MCU.47 21.15,17.25 v21.56,17.36 | C4.2 16.62,20.96 19.36,20.96 19.36,21.96 v19.66,22.36
  Bottom 0.152: v21.56,17.36 21.66,18.86 21.66,19.46 19.56,20.76 v19.66,22.36
VCC  (via drill 0.33)
  Top 0.406: USB.1 23.28,13.04 v22.66,12.53
  Top 0.61: BAT.1 7.26,9.07 Q3.3
  pour Bottom (isolate 0.076, no thermals): 0.46,25.96 0.46,23.96 1.21,23.46 1.46,22.71 1.46,6.46 1.21,5.71 0.96,5.46 0.46,5.21 0.28,2.91 0.96,3.26 1.96,3.46 2.71,3.21 2.96,2.96 3.46,2.21 3.61,1.16 3.46,0.71 3.21,0.46 5.21,0.46 5.46,0.96 5.71,1.21 6.21,1.46 22.71,1.46 23.46,1.21 23.71,0.96 23.96,0.46 25.71,0.46 25.46,0.96 25.21,1.71 25.71,2.71 26.21,3.46 26.96,3.71 27.96,3.71 28.46,3.46 28.46,5.21 27.71,5.46 27.76,6.21 27.66,22.71 27.91,23.36 27.96,23.41 28.66,23.86 28.46,25.71 27.96,25.71 27.71,25.46 26.96,25.71 26.21,26.36 25.76,26.86 25.46,27.71 25.71,28.46 23.96,28.46 23.46,27.96 22.96,27.71 6.21,27.71 5.46,27.96 5.21,28.46 4.46,28.71 3.21,28.71 3.46,28.21 3.46,26.96 2.96,25.96 1.96,25.46 0.96,25.46
VCC-REG  (via drill 0.33)
  Top 0.254: U2.6 U2.7 U2.8 | 10.59,4.09 10.66,4.07 U2.5
  Top 0.305: U2.6 12.26,2.86 | 10.66,4.07 v10.66,2.86
  Top 0.61: C13.1 14.44,2.86 v10.66,2.86 12.26,2.86
  Bottom 0.61: Q3.2 8.21,5.32 v10.66,2.86
  other vias: 8.21,7.72
VDDIO  (via drill 0.33)
  Top 0.152: U1.8 24.77,24.22 C10.1 | U1.1 v22.93,20.16
  Bottom 0.152: C10.1 25.26,23.76 v22.93,20.16
  other vias: 25.56,24.22

### Text on the board
bPlace: ALIENWHOOP F4 | CW | CCW | BOOT | PPM | RX | SRX | 20170424_0027-STEVENSON / REMIX OF ALIENFLIGHT F4 / LICENSE: CC BY-NC-SA 4.0 | CCW | CW | ALIENWHOOP F4
Guide: Released under the Creative Commons Attribution-NonCommercial-ShareAlike 4.0 International License / https://creativecommons.org/licenses/by-nc-sa/4.0/ | THIS BOARD DESIGN IS PROVIDED AS IS WITHOUT ANY EXPRESS OR IMPLIED WARRANTIES. / INCLUDING, BUT NOT LIMITED TO, THE IMPLIED WARRANTIES OF MERCHANTABILITY AND / FITNESS FOR A PARTICULAR PURPOSE. | Remixed from the AlienFlight F4 brushed quad by Charles Stevenson / Lance's original work available at http://alienflight.com/f4-brushed/